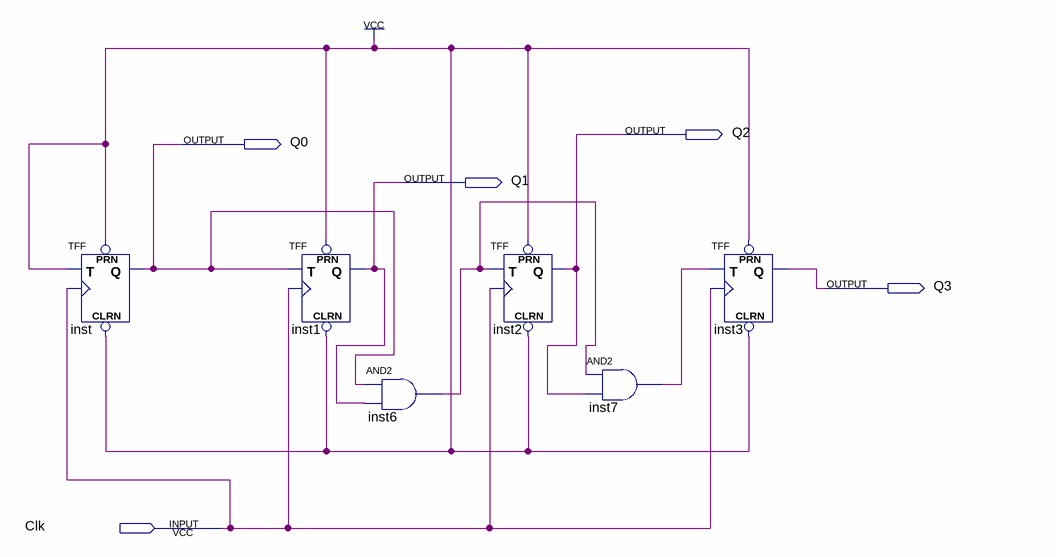
[diagram p0: schematic sheet]
// Quartus schematic lab10step2b.bdf as structural Verilog: 6 symbols, 5 pins
module lab10step2b (
  input  Clk,
  output Q2,
  output Q0,
  output Q1,
  output Q3
);

  wire inst6_out, inst7_out;

  TFF inst (.PRN(1'b1), .CLRN(1'b1), .T(1'b1), .CLK(Clk), .Q(Q0));
  TFF inst1 (.PRN(1'b1), .CLRN(1'b1), .T(Q0), .CLK(Clk), .Q(Q1));
  and inst6 (inst6_out, Q0, Q1);
  TFF inst2 (.PRN(1'b1), .CLRN(1'b1), .T(inst6_out), .CLK(Clk), .Q(Q2));
  and inst7 (inst7_out, inst6_out, Q2);
  TFF inst3 (.PRN(1'b1), .CLRN(1'b1), .T(inst7_out), .CLK(Clk), .Q(Q3));
endmodule
